# EAGLE design 1607_426mhz_module (EAGLE 9.5.1)
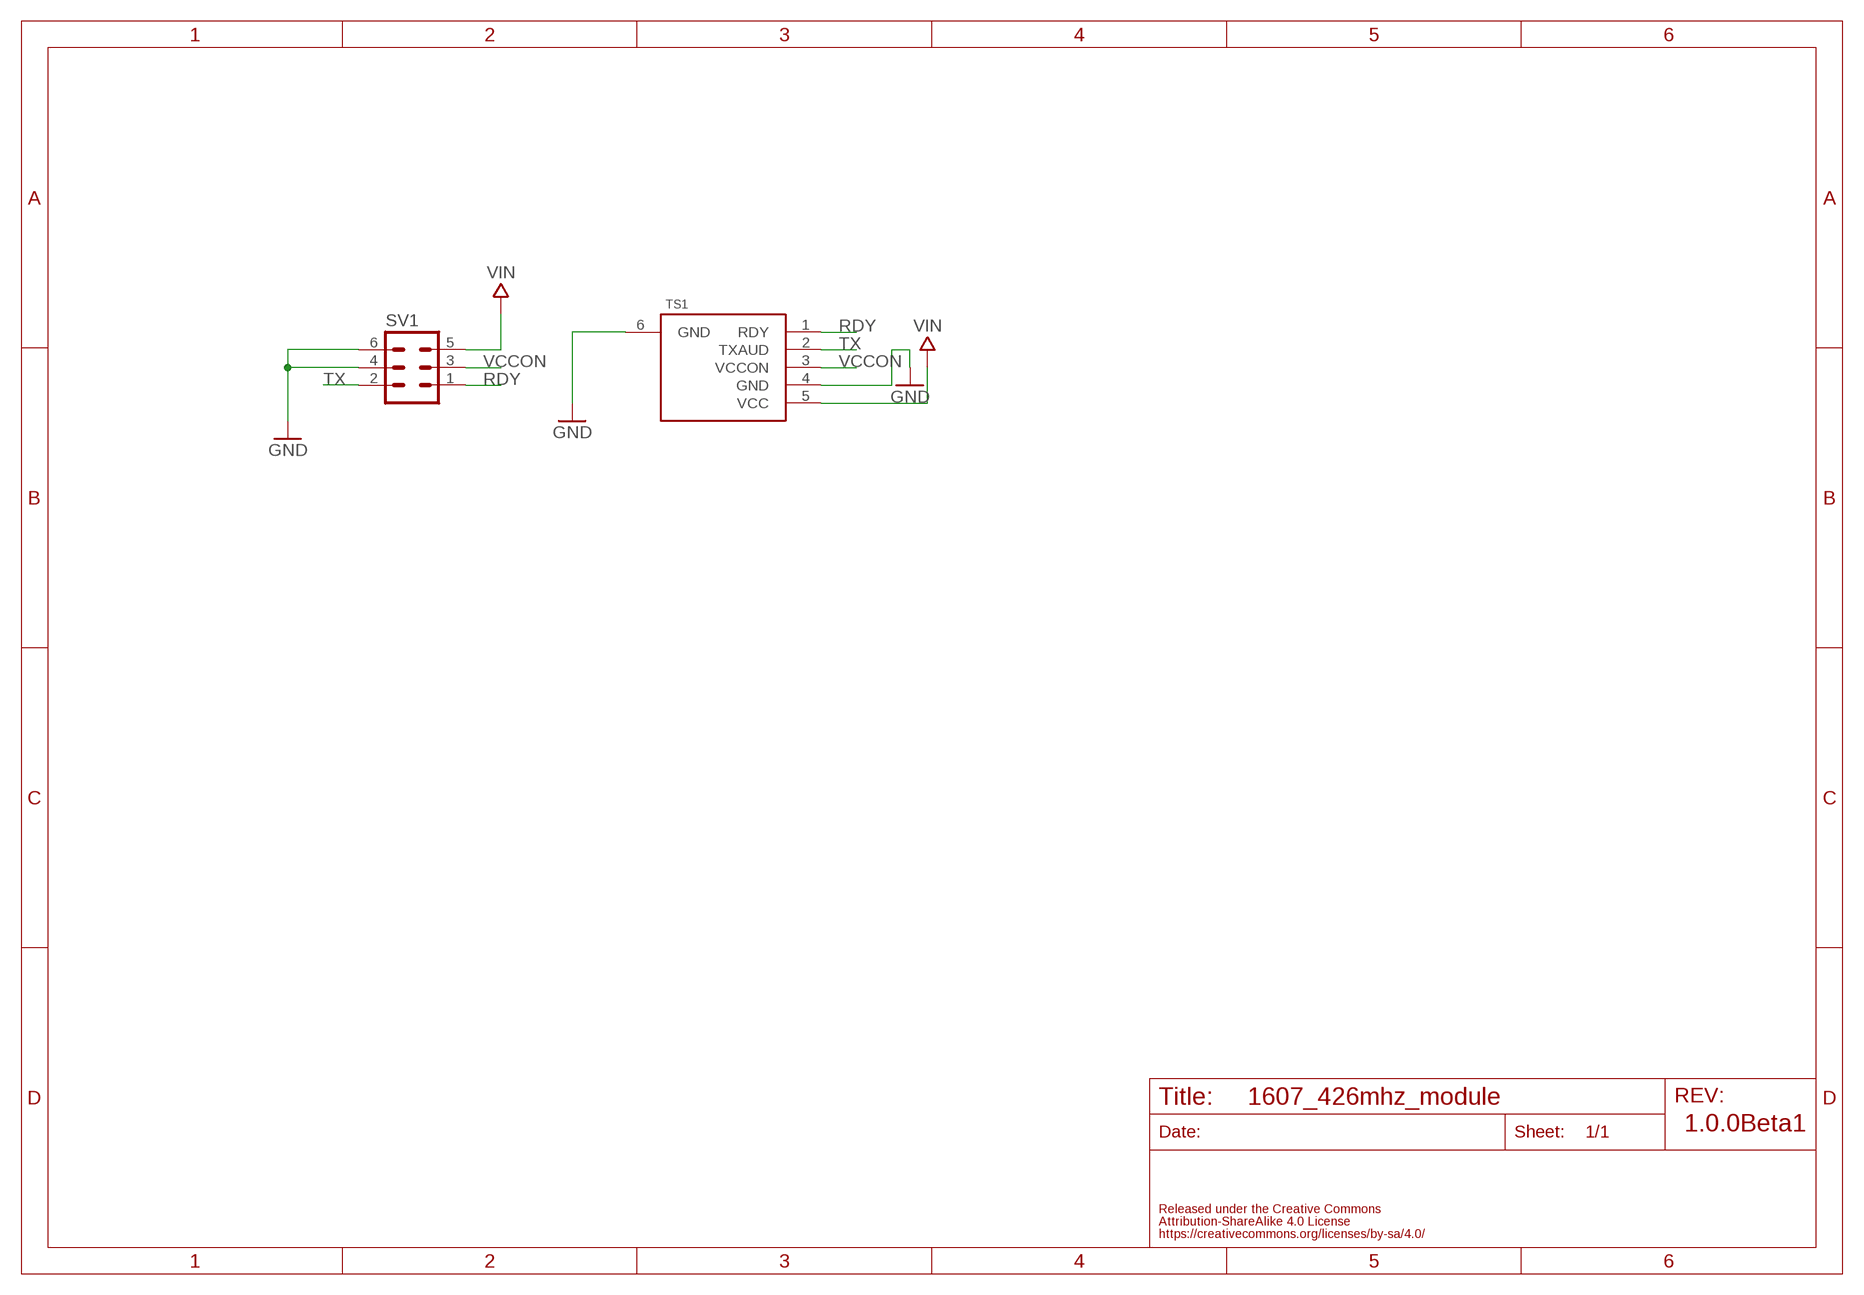
[diagram p0: schematic, sheet 1]

## Parts
SV1  MA03-2  [MA03-2]
TS1  TS01E  [TS01E]

## Nets
GND: SV1.4 SV1.6 TS1.4(GND) TS1.6(GND)
RDY: SV1.1 TS1.1(RDY)
TX: SV1.2 TS1.2(TXAUD)
VCCON: SV1.3 TS1.3(VCCON)
VIN: SV1.5 TS1.5(VCC)

## Notes on the sheet
- 1.0.0Beta1

## Library data of the parts
SV1 = con-lstb:MA03-2: PIN HEADER; OC_FARNELL: unknown; OC_NEWARK: unknown
TS1 = FaBo-420:TS01E

## Board
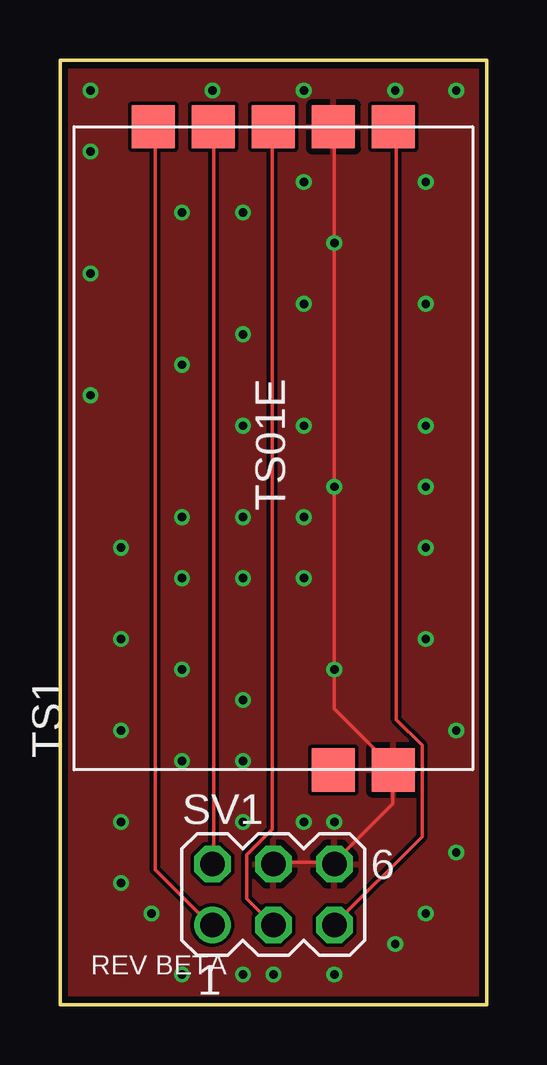
[diagram p1: board, top side]
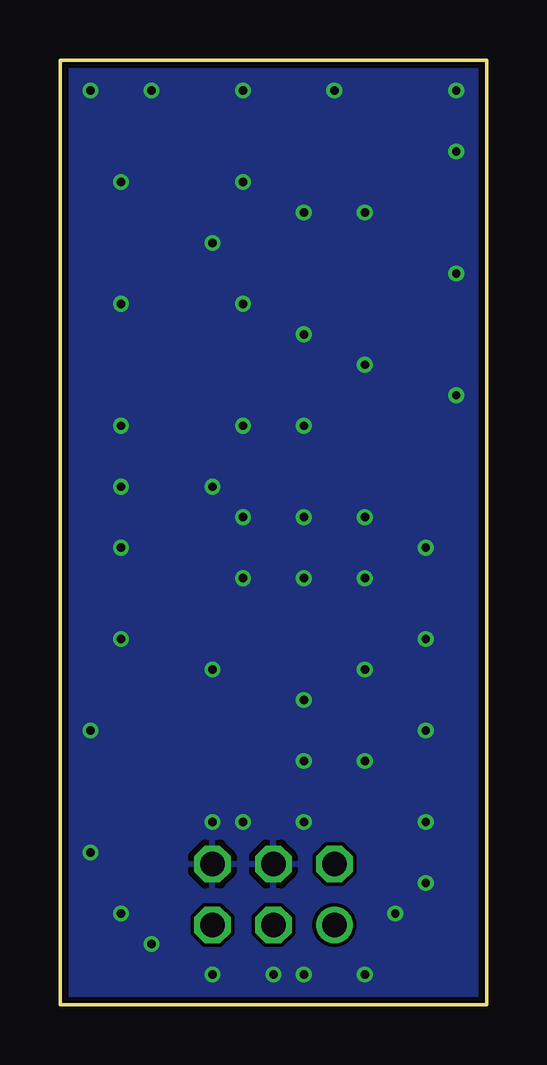
[diagram p2: board, bottom side, seen from below]

Size 17.78 x 39.37 mm. Coordinates in mm from the lower left corner, seen from the top.
Outline: 0,0 0,39.37 17.78,39.37 17.78,0 0,0
Copper layers (1*16): Top 0.035mm / dielectric 1.5mm / Bottom 0.035mm
Design rules "SeeedStudio_2layer_DRU_no_angle_20140221": minimum track width 6mil, minimum drill 12mil, track to track 6mil, track to pad 6mil, pad to pad 6mil, via to via 6mil, smd to smd 0mil, copper to edge 10mil, drill to drill 10mil, minimum pad ring 10mil, minimum via ring 6mil, stop-mask expansion 2mil, vias tented up to drill 100mil, thermal gap 10mil

### Footprints (pad centres in the part's own frame; a part is rotated, then mirrored left to right if it is on the bottom)
MA03-2 = drill 1.016: 1 -2.54,-1.27 | drill 1.016 octagon: 2 -2.54,1.27; 3 0,-1.27; 4 0,1.27; 5 2.54,-1.27; 6 2.54,1.27
TS01E = smd 1.8 x 1.8: 1 13.4,5; 2 13.4,2.5; 3 13.4,0; 4 13.4,-2.5; 5 13.4,-5; 6 -13.4,-5; 7 -13.4,-2.5

### Placement (x,y rotation side)
SV1  8.89,4.6 0 top
TS1  8.89,23.19 90 top

### Tracks (layer width: path | path; a pad name or v marks a point on that pad's centre or on a via)
GND  (via drill 0.35)
  Top 0.152: 11.43,5.94 13.87,8.38 13.87,9.75 TS1.6 13.87,9.91 11.43,12.34 v11.43,21.59 11.43,36.58 TS1.4 | 11.43,5.94 8.99,5.94 SV1.4 | 11.43,5.94 SV1.6
  other vias: 10.16,20.32 7.62,20.32 13.97,2.54 15.24,3.81 11.43,1.27 8.89,1.27 7.62,1.27 5.08,1.27 3.81,3.81 2.54,5.08 2.54,7.62 5.08,10.16 2.54,11.43 7.62,10.16 7.62,12.7 5.08,13.97 2.54,15.24 2.54,19.05 5.08,17.78 7.62,17.78 10.16,17.78 10.16,24.13 15.24,21.59 15.24,19.05 15.24,15.24 16.51,11.43 16.51,6.35 11.43,7.62 10.16,7.62 7.62,7.62 7.62,24.13 7.62,27.94 7.62,33.02 5.08,33.02 5.08,26.67 5.08,20.32 1.27,25.4 1.27,30.48 1.27,35.56 11.43,31.75 10.16,29.21 10.16,34.29 15.24,34.29 16.51,38.1 1.27,38.1 6.35,38.1 10.16,38.1 13.97,38.1 15.24,29.21 15.24,24.13 11.43,13.97
  pour Top: -1.27,-1.27 19.05,-1.27 19.05,40.64 -1.27,40.64
  pour Bottom: -1.27,-1.27 19.05,-1.27 19.05,40.64 -1.27,40.64
RDY
  Top 0.152: TS1.1 3.96,36.58 3.96,5.64 6.25,3.35 SV1.1
TX
  Top 0.152: TS1.2 6.4,36.58 6.4,5.94 SV1.2
VCCON
  Top 0.152: TS1.3 8.84,36.58 8.84,7.32 7.77,6.25 7.77,4.42 8.84,3.35 SV1.3
VIN
  Top 0.152: TS1.5 14.02,36.58 14.02,11.89 15.09,10.82 15.09,7.01 11.43,3.35 SV1.5

### Text on the board
tPlace: REV BETA